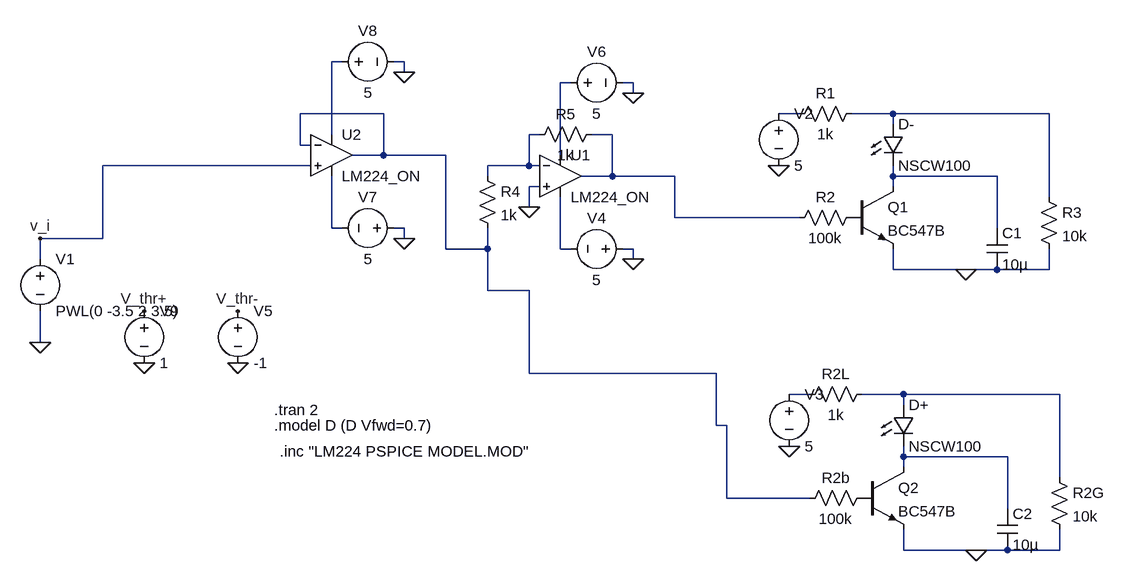
[diagram p0: schematic LEDUI_2.asc]
LEDUI_2.asc, the LTspice schematic file:
Version 4
SHEET 1 880 680
WIRE -528 -160 -544 -160
WIRE -432 -160 -448 -160
WIRE -432 -144 -432 -160
WIRE -176 -128 -192 -128
WIRE -80 -128 -96 -128
WIRE -80 -112 -80 -128
WIRE -464 -80 -592 -80
WIRE 176 -80 144 -80
WIRE 320 -80 256 -80
WIRE 560 -80 320 -80
WIRE 320 -64 320 -80
WIRE -544 -48 -544 -160
WIRE -224 -48 -240 -48
WIRE -112 -48 -144 -48
WIRE -592 -32 -592 -80
WIRE -576 -32 -592 -32
WIRE -464 -16 -464 -80
WIRE -464 -16 -512 -16
WIRE -368 -16 -464 -16
WIRE -192 -16 -192 -128
WIRE -576 0 -896 0
WIRE -240 0 -240 -48
WIRE -240 0 -304 0
WIRE -224 0 -240 0
WIRE -304 16 -304 0
WIRE -112 16 -112 -48
WIRE -112 16 -160 16
WIRE -16 16 -112 16
WIRE 320 16 320 0
WIRE 480 16 320 16
WIRE -224 32 -240 32
WIRE 320 32 320 16
WIRE 560 48 560 -80
WIRE -240 64 -240 32
WIRE -16 80 -16 16
WIRE 176 80 -16 80
WIRE -544 96 -544 16
WIRE -528 96 -544 96
WIRE -432 96 -448 96
WIRE 480 96 480 16
WIRE -896 112 -896 0
WIRE -896 112 -992 112
WIRE -432 112 -432 96
WIRE -368 128 -368 -16
WIRE -304 128 -304 96
WIRE -304 128 -368 128
WIRE -192 128 -192 48
WIRE -176 128 -192 128
WIRE -80 128 -96 128
WIRE -992 144 -992 112
WIRE -80 144 -80 128
WIRE 320 160 320 128
WIRE 432 160 320 160
WIRE 480 160 432 160
WIRE 560 160 560 128
WIRE 560 160 480 160
WIRE -304 192 -304 128
WIRE -240 192 -304 192
WIRE -992 272 -992 224
WIRE -240 320 -240 192
WIRE 48 320 -240 320
WIRE 192 352 160 352
WIRE 336 352 272 352
WIRE 576 352 336 352
WIRE 336 368 336 352
WIRE 48 400 48 320
WIRE 64 400 48 400
WIRE 336 448 336 432
WIRE 496 448 336 448
WIRE 336 464 336 448
WIRE 576 480 576 352
WIRE 64 512 64 400
WIRE 192 512 64 512
WIRE 496 528 496 448
WIRE 336 592 336 560
WIRE 448 592 336 592
WIRE 496 592 448 592
WIRE 576 592 576 560
WIRE 576 592 496 592
FLAG 448 592 0
FLAG -992 272 0
FLAG -992 112 v_i
FLAG 160 432 0
FLAG 432 160 0
FLAG 144 0 0
FLAG -80 144 0
FLAG -80 -112 0
FLAG -240 64 0
FLAG -688 304 0
FLAG -688 224 V_thr-
FLAG -832 304 0
FLAG -832 224 V_thr+
FLAG -432 112 0
FLAG -432 -144 0
SYMBOL voltage -992 128 R0
SYMATTR InstName V1
SYMATTR Value PWL(0 -3.5 2 3.5)
SYMBOL res 288 336 R90
WINDOW 0 0 56 VBottom 2
WINDOW 3 32 56 VTop 2
SYMATTR InstName R2L
SYMATTR Value 1k
SYMBOL res 288 496 R90
WINDOW 0 0 56 VBottom 2
WINDOW 3 32 56 VTop 2
SYMATTR InstName R2b
SYMATTR Value 100k
SYMBOL res 560 464 R0
SYMATTR InstName R2G
SYMATTR Value 10k
SYMBOL npn 272 464 R0
SYMATTR InstName Q2
SYMATTR Value BC547B
SYMBOL LED 320 368 R0
SYMATTR InstName D+
SYMATTR Value NSCW100
SYMBOL voltage 160 336 R0
SYMATTR InstName V3
SYMATTR Value 5
SYMBOL cap 480 528 R0
SYMATTR InstName C2
SYMATTR Value 10µ
SYMBOL OpAmps/opamp2 -192 -48 R0
SYMATTR InstName U1
SYMATTR Value LM224_ON
SYMBOL res 272 -96 R90
WINDOW 0 0 56 VBottom 2
WINDOW 3 32 56 VTop 2
SYMATTR InstName R1
SYMATTR Value 1k
SYMBOL res 272 64 R90
WINDOW 0 0 56 VBottom 2
WINDOW 3 32 56 VTop 2
SYMATTR InstName R2
SYMATTR Value 100k
SYMBOL res 544 32 R0
SYMATTR InstName R3
SYMATTR Value 10k
SYMBOL npn 256 32 R0
SYMATTR InstName Q1
SYMATTR Value BC547B
SYMBOL LED 304 -64 R0
SYMATTR InstName D-
SYMATTR Value NSCW100
SYMBOL voltage 144 -96 R0
SYMATTR InstName V2
SYMATTR Value 5
SYMBOL cap 464 96 R0
SYMATTR InstName C1
SYMATTR Value 10µ
SYMBOL voltage -80 128 R90
WINDOW 0 -32 56 VBottom 2
WINDOW 3 32 56 VTop 2
SYMATTR InstName V4
SYMATTR Value 5
SYMBOL voltage -192 -128 R270
WINDOW 0 32 56 VTop 2
WINDOW 3 -32 56 VBottom 2
SYMATTR InstName V6
SYMATTR Value 5
SYMBOL res -320 0 R0
SYMATTR InstName R4
SYMATTR Value 1k
SYMBOL res -128 -64 R90
WINDOW 0 0 56 VBottom 2
WINDOW 3 32 56 VTop 2
SYMATTR InstName R5
SYMATTR Value 1k
SYMBOL voltage -688 208 R0
SYMATTR InstName V5
SYMATTR Value -1
SYMBOL voltage -832 208 R0
SYMATTR InstName V9
SYMATTR Value 1
SYMBOL OpAmps/opamp2 -544 -80 R0
SYMATTR InstName U2
SYMATTR Value LM224_ON
SYMBOL voltage -432 96 R90
WINDOW 0 -32 56 VBottom 2
WINDOW 3 32 56 VTop 2
SYMATTR InstName V7
SYMATTR Value 5
SYMBOL voltage -544 -160 R270
WINDOW 0 32 56 VTop 2
WINDOW 3 -32 56 VBottom 2
SYMATTR InstName V8
SYMATTR Value 5
TEXT -632 376 Left 2 !.tran 2
TEXT -632 400 Left 2 !.model D (D Vfwd=0.7)
TEXT -624 440 Left 2 !.inc "LM224 PSPICE MODEL.MOD"

The netlist it stands for:
* LEDUI_2.asc
V1 v_i 0 PWL(0 -3.5 2 3.5)
R2L N012 N011 1k
R2b P001 N003 100k
R2G N012 0 10k
Q2 N013 P001 0 0 BC547B
D+ N012 N013 NSCW100
V3 N011 0 5
C2 N013 0 10µ
XU1 0 N006 N002 N010 N007 LM224_ON  ; pins In+ In- V+ V- OUT
R1 N005 N004 1k
R2 P002 N007 100k
R3 N005 0 10k
Q1 N008 P002 0 0 BC547B
D- N005 N008 NSCW100
V2 N004 0 5
C1 N008 0 10µ
V4 0 N010 5
V6 N002 0 5
R4 N006 N003 1k
R5 N007 N006 1k
V5 V_thr- 0 -1
V9 V_thr+ 0 1
XU2 v_i N003 N001 N009 N003 LM224_ON  ; pins In+ In- V+ V- OUT
V7 0 N009 5
V8 N001 0 5
.model D D
.lib standard.dio
.model NPN NPN
.model PNP PNP
.lib standard.bjt
.tran 2
.model D (D Vfwd=0.7)
.inc "LM224 PSPICE MODEL.MOD"
.backanno
.end